# Altium project CSI2-TX2-XAVIER_Rev02.PrjPcb
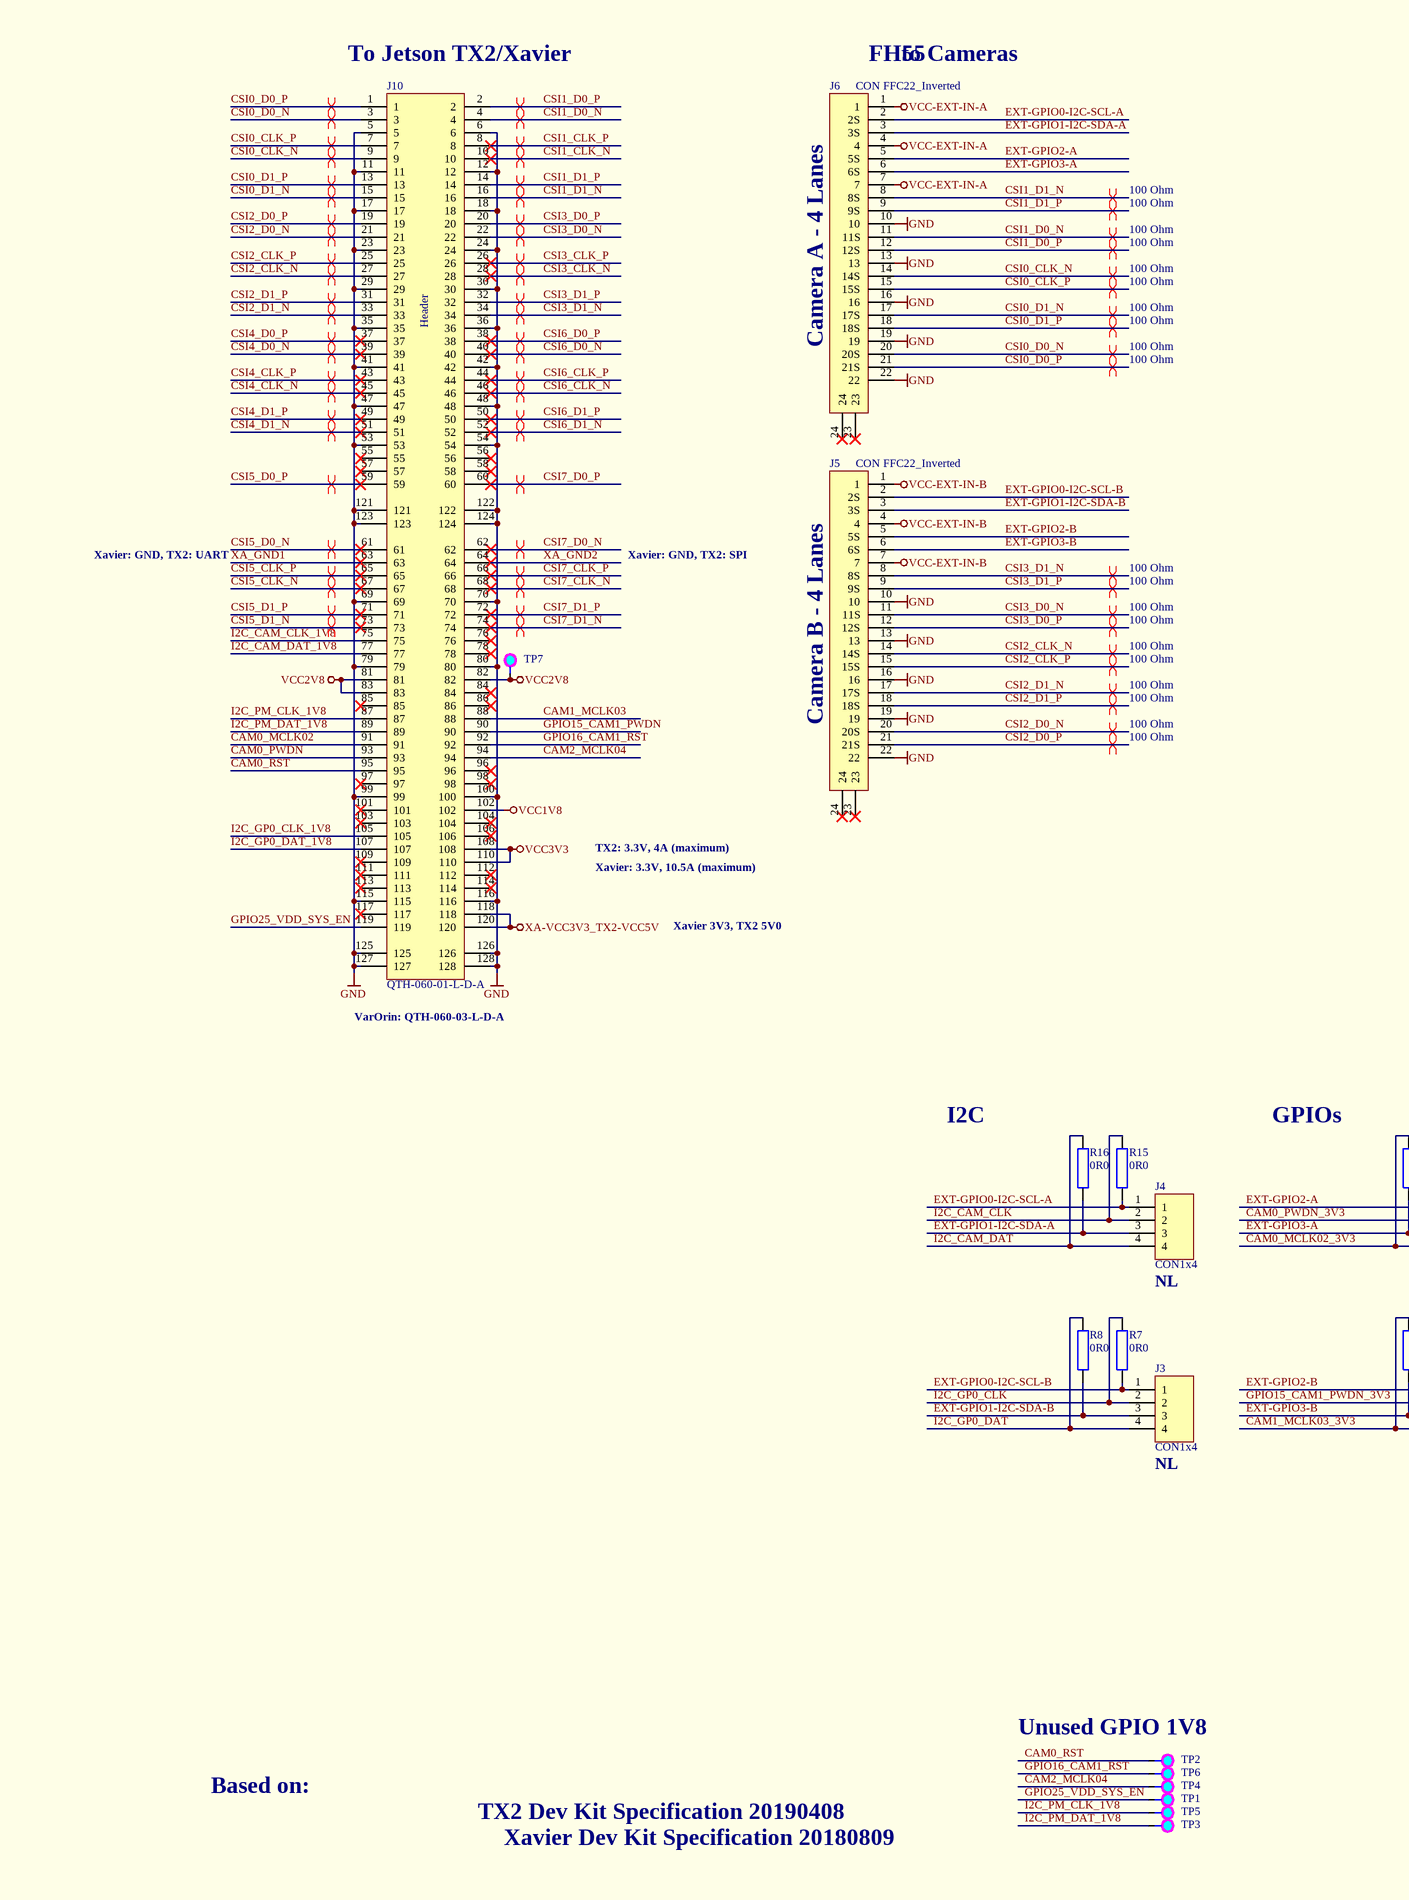
[diagram p0: CSI2-TX2-XAVIER_Rev02.SchDoc, left]
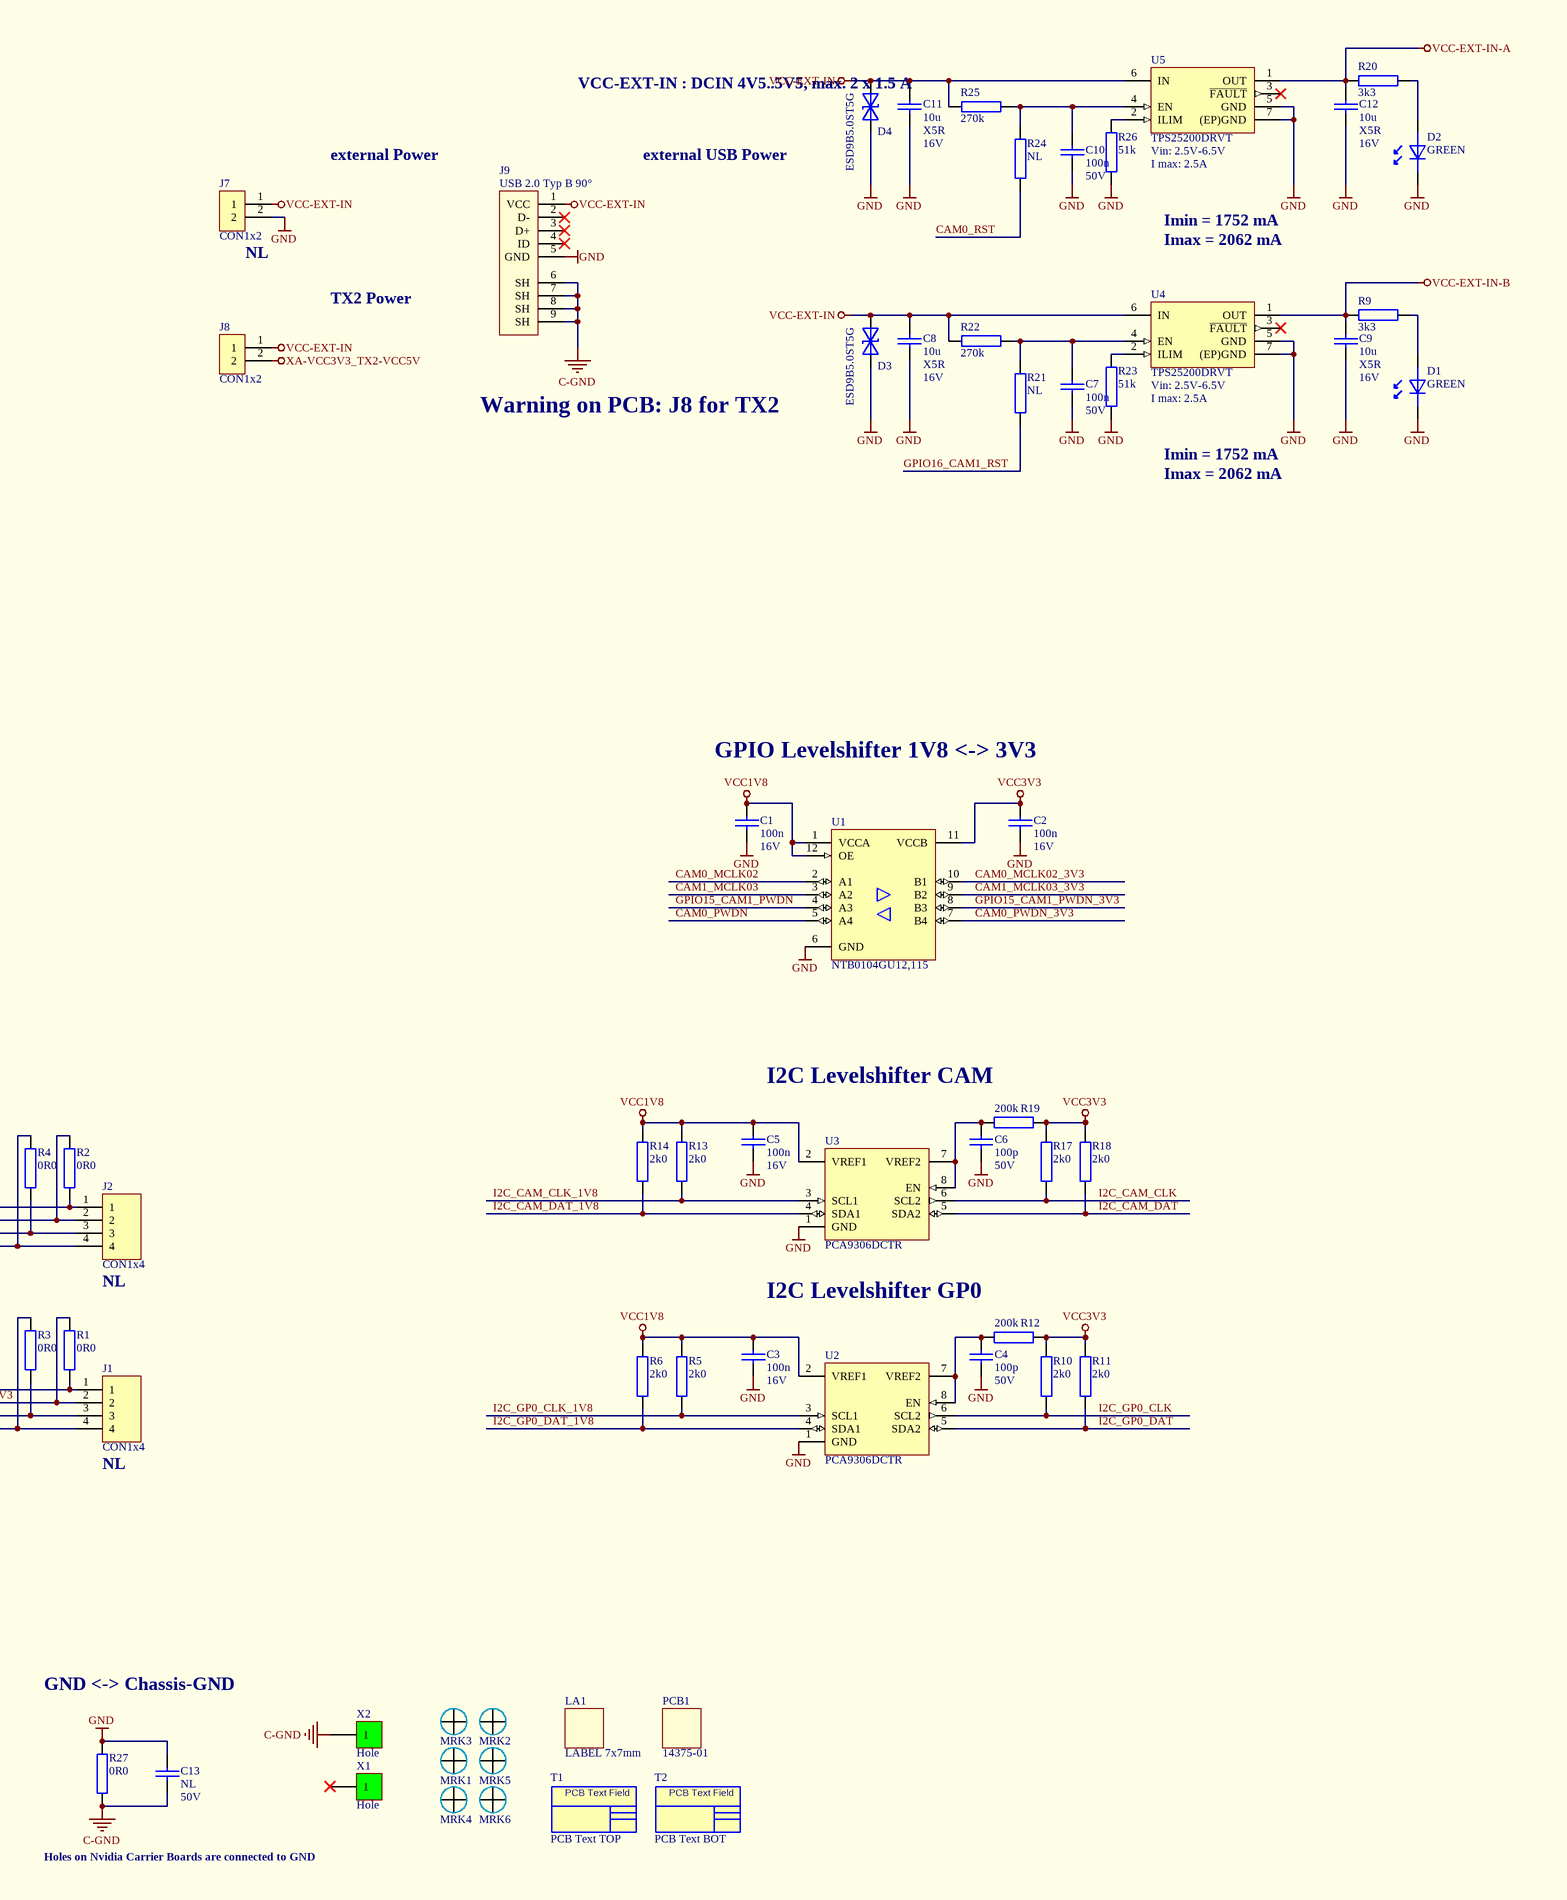
[diagram p1: CSI2-TX2-XAVIER_Rev02.SchDoc, right]
_ProjectName: CSI2-TX2-XAVIER; VariantName: standard; Title: CSI2-TX2-XAVIER_Rev02; RevisionPCB: 02; AuthorPCB: OFU
1 sheet, 78 parts. Net scope: global (net labels, ports and power ports of the same name join across sheets).
Board file: CSI2-TX2-XAVIER_Rev02.PcbDoc

## Sheet CSI2-TX2-XAVIER_Rev02.SchDoc: CSI2-TX2-XAVIER_Rev02
size A2; PageSetup: Record=PageOptions|CenterHorizontal=True|CenterVertical=True|PrintScale=0.71|XCorrection=1.00|YCorrection=1.00|PrintKind=2|BorderSize=5000000|LeftOffset=0|BottomOffset=0|Orientation=2|PaperLength=1000|PaperWidth=1000|Scale=100|PaperSource=7|PrintQuality=-3|MediaType=1|DitherType=10|PrintScaleMode=1|PaperKind=A3|PaperIndex=8; CheckedBy: OFU; Author: CWA; CompanyName: Allied Vision Technologies GmbH; Address1: Taschenweg 2a; Address2: 07646 Stadtroda; Address3: Germany; Revision: 02; SheetNumber: 1; SheetTotal: 1

### Parts
C1  100n  Voltage: 16V  [C-0402_0.55]
C2  100n  Voltage: 16V  [C-0402_0.55]
C3  100n  Voltage: 16V  [C-0402_0.55]
C4  100p  Voltage: 50V  [C-0402_0.55]
C5  100n  Voltage: 16V  [C-0402_0.55]
C6  100p  Voltage: 50V  [C-0402_0.55]
C7  100n  Voltage: 50V  [C-0603_1.0]
C8  10u  Dielectric: X5R  Voltage: 16V  [C-0805_1.4]
C9  10u  Dielectric: X5R  Voltage: 16V  [C-0805_1.4]
C10  100n  Voltage: 50V  [C-0603_1.0]
C11  10u  Dielectric: X5R  Voltage: 16V  [C-0805_1.4]
C12  10u  Dielectric: X5R  Voltage: 16V  [C-0805_1.4]
C13  NL  Voltage: 50V  [C-0603_1.0]
D1  GREEN  [D-0603-LED]
D2  GREEN  [D-0603-LED]
D3  ESD9B5.0ST5G  [D-SOD923]
D4  ESD9B5.0ST5G  [D-SOD923]
J1  CON1x4  [CON 1x4 RM2.54]
J2  CON1x4  [CON 1x4 RM2.54]
J3  CON1x4  [CON 1x4 RM2.54]
J4  CON1x4  [CON 1x4 RM2.54]
J5  CON FFC22_Inverted  [J-FH55-22S-0.5SH - Inverted Pins]
J6  CON FFC22_Inverted  [J-FH55-22S-0.5SH - Inverted Pins]
J7  CON1x2  [CON 1x2 RM2.54]
J8  CON1x2  [CON 1x2 RM2.54]
J9  USB 2.0 Typ B 90°  [J-629105150521]
J10  QTH-060-01-L-D-A  [J-QTH-060-XX-X-D-A]
LA1  LABEL 7x7mm  [PCB LABEL 7x7]
MRK1  Marker Single Layer  [PCB_Marker_Pad_top]  (value not drawn)
MRK2  Marker Single Layer  [PCB_Marker_Pad_top]  (value not drawn)
MRK3  Marker Single Layer  [PCB_Marker_Pad_top]  (value not drawn)
MRK4  Marker Single Layer  [PCB_Marker_Pad_top]  (value not drawn)
MRK5  Marker Single Layer  [PCB_Marker_Pad_top]  (value not drawn)
MRK6  Marker Single Layer  [PCB_Marker_Pad_top]  (value not drawn)
PCB1  14375-01  (mechanical)
R1  0R0  [R-0603_0.6]
R2  0R0  [R-0603_0.6]
R3  0R0  [R-0603_0.6]
R4  0R0  [R-0603_0.6]
R5  2k0  [R-0402_0.4]
R6  2k0  [R-0402_0.4]
R7  0R0  [R-0603_0.6]
R8  0R0  [R-0603_0.6]
R9  3k3  [R-0603_0.6]
R10  2k0  [R-0402_0.4]
R11  2k0  [R-0402_0.4]
R12  200k  [R-0402_0.4]
R13  2k0  [R-0402_0.4]
R14  2k0  [R-0402_0.4]
R15  0R0  [R-0603_0.6]
R16  0R0  [R-0603_0.6]
R17  2k0  [R-0402_0.4]
R18  2k0  [R-0402_0.4]
R19  200k  [R-0402_0.4]
R20  3k3  [R-0603_0.6]
R21  NL  [R-0603_0.6]
R22  270k  [R-0603_0.6]
R23  51k  [R-0603_0.6]
R24  NL  [R-0603_0.6]
R25  270k  [R-0603_0.6]
R26  51k  [R-0603_0.6]
R27  0R0  [R-0603_0.6]
T1  PCB Text TOP  [PCB TEXTFIELD TOP 2]  (no BOM)
T2  PCB Text BOT  [PCB TEXTFIELD BOT 2]  (no BOM)
TP1  TP  [TP_16_10]  (value not drawn)  (no BOM)
TP2  TP  [TP_16_10]  (value not drawn)  (no BOM)
TP3  TP  [TP_16_10]  (value not drawn)  (no BOM)
TP4  TP  [TP_16_10]  (value not drawn)  (no BOM)
TP5  TP  [TP_16_10]  (value not drawn)  (no BOM)
TP6  TP  [TP_16_10]  (value not drawn)  (no BOM)
TP7  TP  [TP_16_10]  (value not drawn)  (no BOM)
U1  NTB0104GU12,115  [IC-XQFN12_1.7x2x0.5]
U2  PCA9306DCTR  [IC-TSSOP8_3.15x4.25x1.3]
U3  PCA9306DCTR  [IC-TSSOP8_3.15x4.25x1.3]
U4  TPS25200DRVT  Vin: 2.5V-6.5V  I max: 2.5A  [IC-DFN06_2.0x2.0x0.8]
U5  TPS25200DRVT  Vin: 2.5V-6.5V  I max: 2.5A  [IC-DFN06_2.0x2.0x0.8]
X1  Hole  [HOLE-3.2-6.0-DK]  (no BOM)
X2  Hole  [HOLE-3.2-6.0-DK]  (no BOM)

### Nets
C-GND: C13.2 J9.6(SH) J9.7(SH) J9.8(SH) J9.9(SH) R27.1 X2.1
GND: C1.2 C2.2 C3.2 C4.2 C5.2 C6.2 C7.2 C8.2 C9.2 C10.2 C11.2 C12.2 C13.1 D1.K D2.K D3.A D4.A J5.10 J5.13 J5.16 J5.19 J5.22 J6.10 J6.13 J6.16 J6.19 J6.22 J7.2 J9.5(GND) J10.5 J10.6 J10.11 J10.12 J10.17 J10.18 J10.23 J10.24 J10.29 J10.30 J10.35 J10.36 J10.41 J10.42 J10.47 J10.48 J10.53 J10.54 J10.69 J10.70 J10.79 J10.80 J10.99 J10.100 J10.115 J10.116 J10.121 J10.122 J10.123 J10.124 J10.125 J10.126 J10.127 J10.128 R23.1 R26.1 R27.2 U1.6(GND) U2.1(GND) U3.1(GND) U4.5(GND) U4.7((EP)GND) U5.5(GND) U5.7((EP)GND)
VCC1V8: C1.1 C3.1 C5.1 J10.102 R5.1 R6.1 R13.1 R14.1 U1.1(VCCA) U1.12(OE) U2.2(VREF1) U3.2(VREF1)
VCC2V8: J10.81 J10.82 J10.83 TP7.1
VCC3V3: C2.1 J10.108 J10.110 R10.2 R11.2 R12.2 R17.2 R18.2 R19.2 U1.11(VCCB)
VCC-EXT-IN: C8.1 C11.1 D3.K D4.K J7.1 J8.1 J9.1(VCC) R22.2 R25.2 U4.6(IN) U5.6(IN)
VCC-EXT-IN-A: C12.1 J6.1 J6.4 J6.7 R20.1 U5.1(OUT)
VCC-EXT-IN-B: C9.1 J5.1 J5.4 J5.7 R9.1 U4.1(OUT)
XA-VCC3V3_TX2-VCC5V: J8.2 J10.118 J10.120
CAM0_MCLK02: J10.91 U1.2(A1)
CAM0_MCLK02_3V3: J2.4 R4.2 U1.10(B1)
CAM0_PWDN: J10.93 U1.5(A4)
CAM0_PWDN_3V3: J2.2 R2.2 U1.7(B4)
CAM0_RST: J10.95 R24.1 TP2.1
CAM1_MCLK03: J10.88 U1.3(A2)
CAM1_MCLK03_3V3: J1.4 R3.2 U1.9(B2)
CAM2_MCLK04: J10.94 TP4.1
CSI0_CLK_N: J6.14(14S) J10.9
CSI0_CLK_P: J6.15(15S) J10.7
CSI0_D0_N: J6.20(20S) J10.3
CSI0_D0_P: J6.21(21S) J10.1
CSI0_D1_N: J6.17(17S) J10.15
CSI0_D1_P: J6.18(18S) J10.13
CSI1_CLK_N: J10.10
CSI1_CLK_P: J10.8
CSI1_D0_N: J6.11(11S) J10.4
CSI1_D0_P: J6.12(12S) J10.2
CSI1_D1_N: J6.8(8S) J10.16
CSI1_D1_P: J6.9(9S) J10.14
CSI2_CLK_N: J5.14(14S) J10.27
CSI2_CLK_P: J5.15(15S) J10.25
CSI2_D0_N: J5.20(20S) J10.21
CSI2_D0_P: J5.21(21S) J10.19
CSI2_D1_N: J5.17(17S) J10.33
CSI2_D1_P: J5.18(18S) J10.31
CSI3_CLK_N: J10.28
CSI3_CLK_P: J10.26
CSI3_D0_N: J5.11(11S) J10.22
CSI3_D0_P: J5.12(12S) J10.20
CSI3_D1_N: J5.8(8S) J10.34
CSI3_D1_P: J5.9(9S) J10.32
CSI4_CLK_N: J10.45
CSI4_CLK_P: J10.43
CSI4_D0_N: J10.39
CSI4_D0_P: J10.37
CSI4_D1_N: J10.51
CSI4_D1_P: J10.49
CSI5_CLK_N: J10.67
CSI5_CLK_P: J10.65
CSI5_D0_N: J10.61
CSI5_D0_P: J10.59
CSI5_D1_N: J10.73
CSI5_D1_P: J10.71
CSI6_CLK_N: J10.46
CSI6_CLK_P: J10.44
CSI6_D0_N: J10.40
CSI6_D0_P: J10.38
CSI6_D1_N: J10.52
CSI6_D1_P: J10.50
CSI7_CLK_N: J10.68
CSI7_CLK_P: J10.66
CSI7_D0_N: J10.62
CSI7_D0_P: J10.60
CSI7_D1_N: J10.74
CSI7_D1_P: J10.72
EXT-GPIO0-I2C-SCL-A: J4.1 J6.2(2S) R15.1
EXT-GPIO0-I2C-SCL-B: J3.1 J5.2(2S) R7.1
EXT-GPIO1-I2C-SDA-A: J4.3 J6.3(3S) R16.1
EXT-GPIO1-I2C-SDA-B: J3.3 J5.3(3S) R8.1
EXT-GPIO2-A: J2.1 J6.5(5S) R2.1
EXT-GPIO2-B: J1.1 J5.5(5S) R1.1
EXT-GPIO3-A: J2.3 J6.6(6S) R4.1
EXT-GPIO3-B: J1.3 J5.6(6S) R3.1
GPIO15_CAM1_PWDN: J10.90 U1.4(A3)
GPIO15_CAM1_PWDN_3V3: J1.2 R1.2 U1.8(B3)
GPIO16_CAM1_RST: J10.92 R21.1 TP6.1
GPIO25_VDD_SYS_EN: J10.119 TP1.1
I2C_CAM_CLK: J4.2 R15.2 R17.1 U3.6(SCL2)
I2C_CAM_CLK_1V8: J10.75 R13.2 U3.3(SCL1)
I2C_CAM_DAT: J4.4 R16.2 R18.1 U3.5(SDA2)
I2C_CAM_DAT_1V8: J10.77 R14.2 U3.4(SDA1)
I2C_GP0_CLK: J3.2 R7.2 R10.1 U2.6(SCL2)
I2C_GP0_CLK_1V8: J10.105 R5.2 U2.3(SCL1)
I2C_GP0_DAT: J3.4 R8.2 R11.1 U2.5(SDA2)
I2C_GP0_DAT_1V8: J10.107 R6.2 U2.4(SDA1)
I2C_PM_CLK_1V8: J10.87 TP5.1
I2C_PM_DAT_1V8: J10.89 TP3.1
XA_GND1: J10.63
XA_GND2: J10.64
NetC4_1: C4.1 R12.1 U2.7(VREF2) U2.8(EN)
NetC6_1: C6.1 R19.1 U3.7(VREF2) U3.8(EN)
NetC7_1: C7.1 R21.2 R22.1 U4.4(EN)
NetC10_1: C10.1 R24.2 R25.1 U5.4(EN)
NetD1_A: D1.A R9.2
NetD2_A: D2.A R20.2
NetR23_2: R23.2 U4.2(ILIM)
NetR26_2: R26.2 U5.2(ILIM)

Not connected (* = marked no-connect by the designer): J5 23* 24*; J6 23* 24*; J9 2(D-)* 3(D+)* 4(ID)*; J10 55* 56* 57* 58* 76* 78* 84* 85* 86* 96* 97* 98* 101* 103* 104* 106* 109* 111* 112* 113* 114* 117*; U4 3(~{FAULT})*; U5 3(~{FAULT})*; X1 1*

### Layout directives
differential pair; net class 100 Ohm: CSI0_CLK_N, CSI0_CLK_P, CSI0_D0_N, CSI0_D0_P, CSI0_D1_N, CSI0_D1_P, CSI1_D0_N, CSI1_D0_P, CSI1_D1_N, CSI1_D1_P, CSI2_CLK_N, CSI2_CLK_P, CSI2_D0_N, CSI2_D0_P, CSI2_D1_N, CSI2_D1_P, CSI3_D0_N, CSI3_D0_P, CSI3_D1_N, CSI3_D1_P
differential pair: CSI0_CLK_N, CSI0_CLK_P, CSI0_D0_N, CSI0_D0_P, CSI0_D1_N, CSI0_D1_P, CSI1_CLK_N, CSI1_CLK_P, CSI1_D0_N, CSI1_D0_P, CSI1_D1_N, CSI1_D1_P, CSI2_CLK_N, CSI2_CLK_P, CSI2_D0_N, CSI2_D0_P, CSI2_D1_N, CSI2_D1_P, CSI3_CLK_N, CSI3_CLK_P, CSI3_D0_N, CSI3_D0_P, CSI3_D1_N, CSI3_D1_P, CSI4_CLK_N, CSI4_CLK_P, CSI4_D0_N, CSI4_D0_P, CSI4_D1_N, CSI4_D1_P, CSI5_CLK_N, CSI5_CLK_P, CSI5_D0_N, CSI5_D0_P, CSI5_D1_N, CSI5_D1_P, CSI6_CLK_N, CSI6_CLK_P, CSI6_D0_N, CSI6_D0_P, CSI6_D1_N, CSI6_D1_P, CSI7_CLK_N, CSI7_CLK_P, CSI7_D0_N, CSI7_D0_P, CSI7_D1_N, CSI7_D1_P

### Notes on the sheet
- (near J10) To Jetson TX2/Xavier
- (near J6) FH55
- (near J6) to Cameras
- VCC-EXT-IN : DCIN 4V5..5V5, max. 2 x 1.5 A
- (near J7) external Power
- (near J9) external USB Power
- Imin = 1752 mA
- Imax = 2062 mA
- (near J7) NL
- (near J8) TX2 Power
- (near J6) Camera A - 4 Lanes
- (near J8) Warning on PCB: J8 for TX2
- Xavier: GND, TX2: UART
- Xavier: GND, TX2: SPI
- (near J5) Camera B - 4 Lanes
- GPIO Levelshifter 1V8 <-> 3V3
- TX2: 3.3V, 4A (maximum)
- Xavier: 3.3V, 10.5A (maximum)
- Xavier 3V3, TX2 5V0
- (near J10) VarOrin: QTH-060-03-L-D-A
- I2C Levelshifter CAM
- I2C
- GPIOs
- (near J4) NL
- (near J2) NL
- I2C Levelshifter GP0
- (near J3) NL
- (near J1) NL
- Unused GPIO 1V8
- GND <-> Chassis-GND
- Based on:
- TX2 Dev Kit Specification 20190408
- Xavier Dev Kit Specification 20180809
- Holes on Nvidia Carrier Boards are connected to GND
- Author:
- Title:
- PCB:
- Checked by:
- PCBA:
- 2
- 3
- Confidential
- File:
- Date:
- Page:
- of
- No.
- 1
- Changes
- Rev.:
- Name:
- (in symbol CON QTH-060-01-L-D-A) Header
- (in symbol PCB TEXT FIELD BOT) PCB Text Field
- (in symbol PCB TEXT FIELD TOP) PCB Text Field

### Library data of the parts
C1-C3 C5 = C 100N 10% 16V X7R 402: Capacitor Ceramic SMD/0402/16V/X7R/10%; KHK Part Number: K8340114; Manufacturer: several; Dielectric: X7R; Tolerance: 10%; Manufacturer Part Number: several
C4 C6 = C 100P 50V X7R 0402: Capacitor Ceramic SMD/0402/50V/X7R/10%; KHK Part Number: K8340145; Manufacturer: several; Dielectric: X7R; Tolerance: 10%; Manufacturer Part Number: several
C7 C10 = C 100N 50V X7R 0603: Capacitor Ceramic SMD/0603/50V/X7R/10%; KHK Part Number: K8340023; Manufacturer: several; Dielectric: X7R; Tolerance: 10%; Manufacturer Part Number: several
C8 C9 C11 C12 = C 10U 16V X5R 0805: Capacitor Ceramic SMD/0805/16V/X5R/10%; KHK Part Number: K8340151; Manufacturer: several; Tolerance: 10%; Manufacturer Part Number: several
C13 = C X 0603: Capacitor Ceramic SMD/0603/50V/X7R/10%; Manufacturer: several; Dielectric: X7R; Tolerance: 10%; Manufacturer Part Number: several
D1 D2 = D LED 0603 green: Chip LED green 430mcd; KHK Part Number: 8172; Manufacturer: Würth; Manufacturer Part Number: 150060GS75000; Current: 20mA; Color: green
D3 D4 = D ESD9B5.0ST5G: DIODE TVS; 400W; 5.8-7.8V; BIDIRECT; KHK Part Number: 7250; Manufacturer: ON Semiconductor; Manufacturer Part Number: ESD9B5.0ST5G
J1-J4 = CON 1x4 2.54: Stiftleiste; 1x4; 2.54mm; gerade; Manufacturer: Harwin; Manufacturer Part Number: M20-999 0445; KHK Part Number: K7600564
J5 J6 = CON FFC22_FH55-22S-0.5SH_Inverted: FFC Connector 0.5mm shielded; KHK Part Number: 10357; Manufacturer: Hirose; Manufacturer Part Number: FH55-22S-0.5SH
J7 J8 = CON 1x2 2.54: Stiftleiste; 1x2; 2.54mm; gerade; Manufacturer: fischer elektronik; Manufacturer Part Number: SL 11 124 2 G; KHK Part Number: K7600582
J9 = CON USB 2.0 Typ B 90°: Micro USB 2.0 Typ B 90°; KHK Part Number: 14360; Manufacturer: WE; Manufacturer Part Number: 629 105 150 521
J10 = CON QTH-060-01-L-D-A: 120pin B2B Header 0.5 pitch 10.27mm Height; Manufacturer: SamTec; KHK Part Number: 10657; Manufacturer Part Number: QTH-060-01-L-D-A
LA1 = PCB LABEL 7x7: Manufacturer: several; Manufacturer Part Number: several
MRK1-MRK6 = PCB Marker Pad Single Layer: Position Marker for PCBs
PCB1 = PCB: PCB ML04; Manufacturer: several; KHK Part Number: 14375-01; Manufacturer Part Number: 14375-01
R1-R4 R27 = R 0R0 1% 0603: Standard Resistor SMD/0603/1%/100mW/TK200; KHK Part Number: K8250041; Manufacturer: several; Tolerance: 1%; Manufacturer Part Number: several; Temperature Coefficient: *
R5 R6 R10 R11 R13 R14 R17 R18 = R 2k0 1% 0402: Standard Resistor SMD/0402/1%/63mW/TK100; KHK Part Number: K8250311; Manufacturer: several; Temperature Coefficient: TK100; Tolerance: 1%; Manufacturer Part Number: several
R7 R8 R15 R16 = R 0R0 1% 0603: Standard Resistor SMD/0603/1%/100mW/TK100; KHK Part Number: K8250041; Manufacturer: several; Tolerance: 1%; Manufacturer Part Number: several; Temperature Coefficient: *
R9 R20 = R 3K3 1% 0603: Standard Resistor SMD/0603/1%/100mW/TK100; KHK Part Number: K8250070; Manufacturer: several; Tolerance: 1%; Manufacturer Part Number: several
R12 R19 = R 200K 1% 0402: Standard Resistor SMD/0402/1%/63mW/TK100; KHK Part Number: K8250280; Manufacturer: several; Temperature Coefficient: TK100; Tolerance: 1%; Manufacturer Part Number: several
R21 R24 = R X 0603: Standard Resistor SMD/0603/1%/100mW/TK200; Tolerance: 1%; Temperature Coefficient: TK100
R22 R25 = R 270K 1% 0603: Standard Resistor SMD/0603/1%/100mW/TK100; KHK Part Number: K8250170; Manufacturer: several; Tolerance: 1%; Temperature Coefficient: na; Manufacturer Part Number: several
R23 R26 = R 51K 1% 0603: Standard Resistor SMD/0603/1%/100mW/TK100; KHK Part Number: K8250156; Manufacturer: several; Tolerance: 1%; Manufacturer Part Number: several
T1 = PCB TEXT FIELD TOP: PCB Textfield TOP
T2 = PCB TEXT FIELD BOT: PCB Textfield BOT
TP1-TP7 = TP_16_10: Testpoint: Pad=1,6mm; Hole=1,0mm
U1 = IC NTB0104GU12,115: IC/LOGIC/Levelshifter;Auto-Dir;Bidirectional;Push-Pull;-40-+125°C/; Manufacturer: NXP; KHK Part Number: 14383; Manufacturer Part Number: NTB0104GU12,115
U2 U3 = IC PCA9306DCTR: IC/LOGIC/LEVELSHIFTER;I2C;AUTO-DIR;1V2-5V/SSOP-8/4.25x3.15x1.3mm; KHK Part Number: 9555; Manufacturer: TI; Manufacturer Part Number: PCA9306DCTR
U4 U5 = IC  TPS25200DRVT: IC/PWR/LOADSW;2V5-6V5;2A5;0R099/6-WDFN/2x2x0.8mm; KHK Part Number: 14277; Manufacturer: Texas Instruments; Manufacturer Part Number: TPS25200DRVT
X1 X2 = PCB HOLE M3-6-DK: HOLE M3

## Assembly variants
standard: all parts fitted
VarOrin: all parts fitted